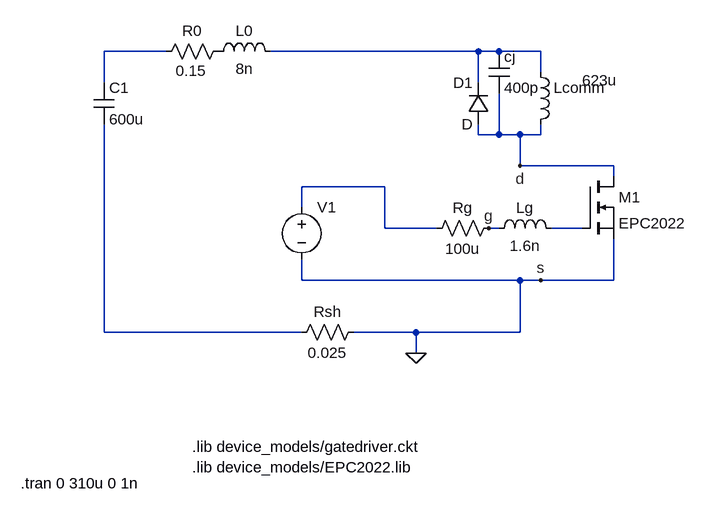
[diagram p0: schematic epc2022_dpt.asc]
epc2022_dpt.asc, the LTspice schematic file:
Version 4
SHEET 1 1224 808
WIRE -128 0 -224 0
WIRE 352 0 32 0
WIRE 384 0 352 0
WIRE 448 0 384 0
WIRE 448 32 448 0
WIRE -224 48 -224 0
WIRE 352 48 352 0
WIRE 352 128 352 112
WIRE 384 128 384 64
WIRE 384 128 352 128
WIRE 416 128 384 128
WIRE 448 128 448 112
WIRE 448 128 416 128
WIRE 416 176 416 128
WIRE 560 176 416 176
WIRE 560 192 560 176
WIRE 208 208 80 208
WIRE 80 240 80 208
WIRE 208 272 208 208
WIRE 288 272 208 272
WIRE 384 272 368 272
WIRE 512 272 464 272
WIRE 80 352 80 320
WIRE 416 352 80 352
WIRE 448 352 416 352
WIRE 560 352 560 288
WIRE 560 352 448 352
WIRE -224 432 -224 112
WIRE 80 432 -224 432
WIRE 256 432 160 432
WIRE 416 432 416 352
WIRE 416 432 256 432
WIRE 256 464 256 432
FLAG 368 272 g
FLAG 256 464 0
FLAG 416 176 d
FLAG 448 352 s
SYMBOL ind 432 16 R0
WINDOW 3 80 28 Left 2
SYMATTR Value 623u
SYMATTR InstName Lcomm
SYMBOL diode 368 112 R180
WINDOW 0 24 64 Left 2
WINDOW 3 24 0 Left 2
SYMATTR InstName D1
SYMBOL ind 368 288 R270
WINDOW 0 32 56 VTop 2
WINDOW 3 5 56 VBottom 2
SYMATTR InstName Lg
SYMATTR Value 1.6n
SYMBOL res 176 416 R90
WINDOW 0 0 56 VBottom 2
WINDOW 3 32 56 VTop 2
SYMATTR InstName Rsh
SYMATTR Value 0.025
SYMBOL nmos 512 192 R0
SYMATTR InstName M1
SYMATTR Value EPC2022
SYMATTR Prefix X
SYMBOL cap -240 48 R0
SYMATTR InstName C1
SYMATTR Value 600u
SYMATTR Value2 ic=54
SYMBOL res -32 -16 R90
WINDOW 0 0 56 VBottom 2
WINDOW 3 30 58 VTop 2
SYMATTR InstName R0
SYMATTR Value 0.15
SYMBOL ind -64 16 R270
WINDOW 0 32 56 VTop 2
WINDOW 3 5 56 VBottom 2
SYMATTR InstName L0
SYMATTR Value 8n
SYMBOL voltage 80 224 R0
WINDOW 3 24 96 Invisible 2
WINDOW 123 0 0 Left 0
WINDOW 39 0 0 Left 0
SYMATTR Value PWL file=C:\Users\usr\Documents\UT_Framework_3.0.1\SPICE_Files\Device_Models\gate.csv
SYMATTR InstName V1
SYMBOL res 384 256 R90
WINDOW 0 0 56 VBottom 2
WINDOW 3 32 56 VTop 2
SYMATTR InstName Rg
SYMATTR Value 100u
SYMBOL cap 368 0 R0
SYMATTR InstName cj
SYMATTR Value 400p
TEXT -88 640 Left 2 !.lib device_models/EPC2022.lib
TEXT -352 664 Left 2 !.tran 0 310u 0 1n
TEXT -88 608 Left 2 !.lib device_models/gatedriver.ckt

The netlist it stands for:
* epc2022_dpt.asc
Lcomm N002 d 623u
D1 d N002 D
Lg g N004 1.6n
Rsh 0 N005 0.025
XM1 d N004 0 EPC2022  ; pins D G S
C1 N001 N005 600u ic=54
R0 P001 N001 0.15
L0 P001 N002 8n
V1 N003 0 PWL file=C:\Users\usr\Documents\UT_Framework_3.0.1\SPICE_Files\Device_Models\gate.csv
Rg g N003 100u
cj N002 d 400p
.model D D
.lib standard.dio
.lib device_models/EPC2022.lib
.tran 0 310u 0 1n
.lib device_models/gatedriver.ckt
.backanno
.end